# Altium project ADC1.PrjPcb
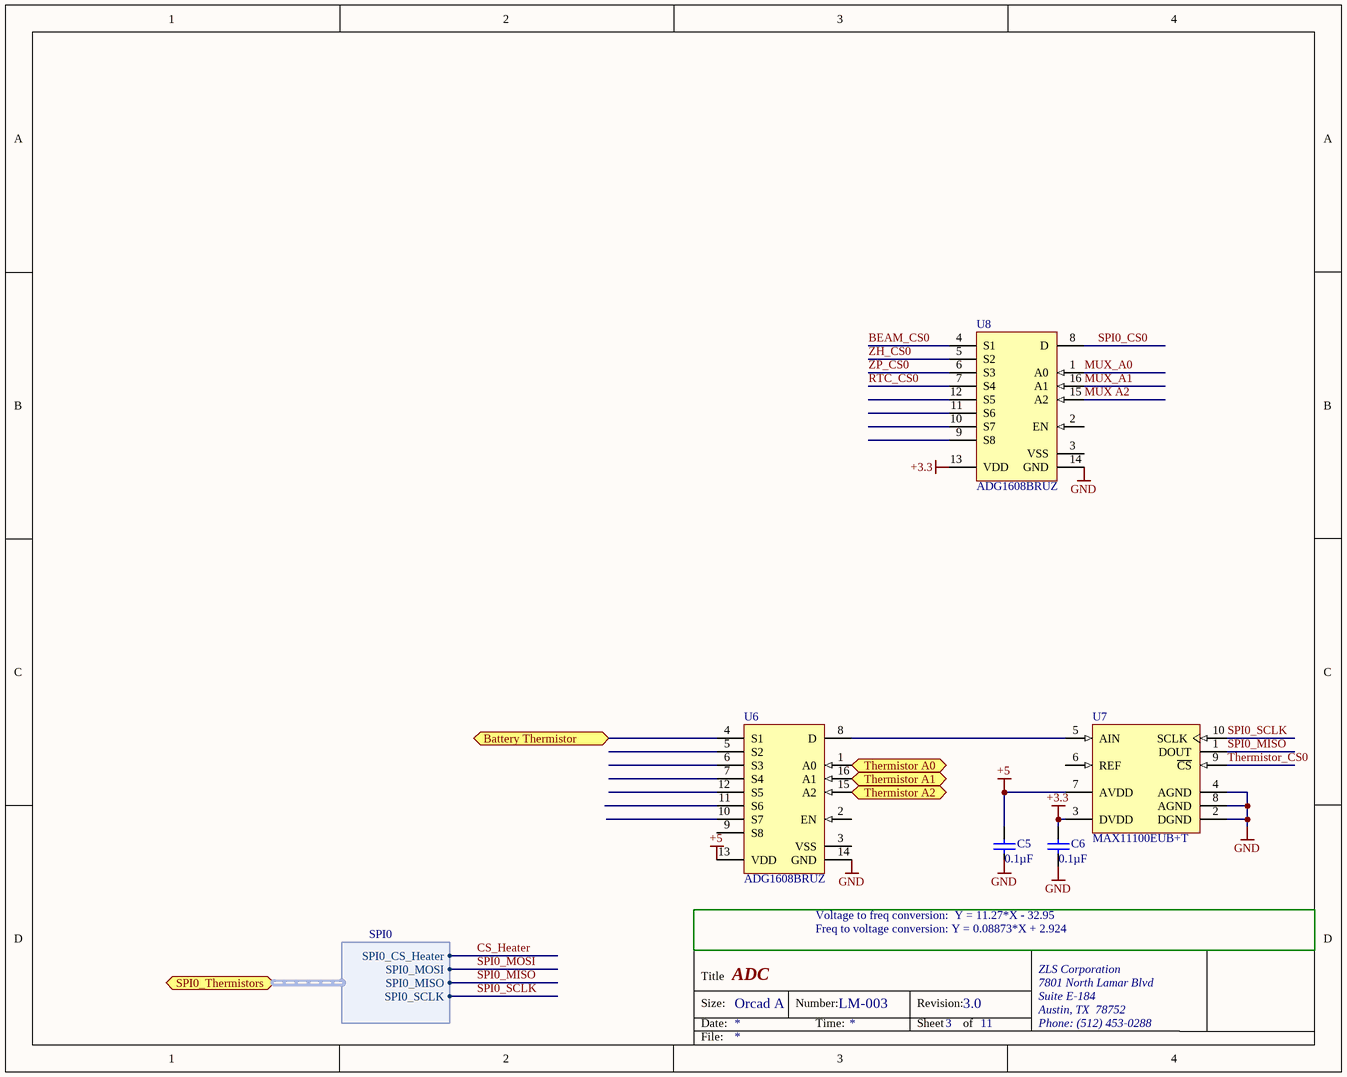
[diagram p0: ADC.SchDoc]
1 sheet, 5 parts. Net scope: flat (ports and power ports of the same name join across sheets).

## Sheet ADC.SchDoc: ADC
size OrCAD A; DocumentNumber: LM-003; Revision: 3.0; SheetNumber: 3; SheetTotal: 11

### Parts
C5  Capacitance: 0.1µF  [CAPC0805(2012)145_N]  (hidden comment: CAP CER 0.1UF 25V X7R 0805)
C6  Capacitance: 0.1µF  [CAPC0805(2012)145_N]  (hidden comment: CAP CER 0.1UF 25V X7R 0805)
U6  ADG1608BRUZ  [ADI-RU-16_M]
U7  MAX11100EUB+T  [U10+2_L]
U8  ADG1608BRUZ  [ADI-RU-16_M]

### Ports
Battery Thermistor, SPI0_Thermistors (harness SPI0), Thermistor A0, Thermistor A1, Thermistor A2

### Harnesses
SPI0: SPI0_CS_Heater, SPI0_MOSI, SPI0_MISO, SPI0_SCLK

### Nets
+3.3: C6.1 U7.3(DVDD) U8.13(VDD)
+5: C5.1 U6.13(VDD) U7.7(AVDD)
GND: C6.2 U6.14(GND) U7.2(DGND) U7.4(AGND) U7.8(AGND) U8.14(GND)
BEAM_CS0: U8.4(S1)
CS_Heater: port SPI0_Thermistors.SPI0_CS_Heater
MUX A2: U8.15(A2)
MUX_A0: U8.1(A0)
MUX_A1: U8.16(A1)
RTC_CS0: U8.7(S4)
SPI0_CS0: U8.8(D)
SPI0_MISO: U7.1(DOUT) ; port SPI0_Thermistors.SPI0_MISO
SPI0_MOSI: port SPI0_Thermistors.SPI0_MOSI
SPI0_SCLK: U7.10(SCLK) ; port SPI0_Thermistors.SPI0_SCLK
Thermistor_CS0: U7.9(~{CS})
ZH_CS0: U8.5(S2)
ZP_CS0: U8.6(S3)
NetU6_1: U6.1(A0) ; port Thermistor A0
NetU6_4: U6.4(S1) ; port Battery Thermistor
NetU6_8: U6.8(D) U7.5(AIN)
NetU6_15: U6.15(A2) ; port Thermistor A2
NetU6_16: U6.16(A1) ; port Thermistor A1

Not connected (* = marked no-connect by the designer): C5 2; U6 2(EN) 3(VSS) 5(S2) 6(S3) 7(S4) 9(S8) 10(S7) 11(S6) 12(S5); U7 6(REF); U8 2(EN) 3(VSS) 9(S8) 10(S7) 11(S6) 12(S5)

### Notes on the sheet
- Freq to voltage conversion: Y = 0.08873*X + 2.924
- Voltage to freq conversion:  Y = 11.27*X - 32.95
- Labels drawn without touching a wire or pin: GND
- Title
- Size:
- Date:
- Orcad A
- Number:
- Time:
- Revision:
- Sheet
- of
- ZLS Corporation
- 7801 North Lamar Blvd
- Suite E-184
- Austin, TX  78752
- Phone: (512) 453-0288
- File:

### Library data of the parts
C5 C6 = CMP-1036-04795-1: Manufacturer: Murata Electronics North America; Manufacturer Part Number: GRM21BR71E104KA01L; Tolerance: ±10%; Supplier 1: Digi-Key; Supplier Part Number 1: 490-1673-6-ND; RoHS: RoHS Compliant; Category: Capacitors; Stock 1: 891652; Pricing 1: 1=0.2, 10=0.145, 100=0.0683, 500=0.04788, 1000=0.03964 (USD); Packaging: Digi-Reel®; Part Status: Active; Voltage - Rated: 25V; Temperature Coefficient: X7R; Operating Temperature: -55°C ~ 125°C; Features: -; Ratings: -; Applications: General Purpose; Mounting Type: Surface Mount, MLCC; Package / Case: 0805 (2012 Metric); Size / Dimension: 0.079" L x 0.049" W (2.00mm x 1.25mm); Height - Seated (Max): -; Thickness (Max): 0.053" (1.35mm); Lead Spacing: -; Lead Style: -; ComponentLink1URL: http://www.murata.com/~/media/webrenewal/support/library/catalog/products/capacitor/mlcc/c02e.ashx; ComponentLink1Description: http://www.murata.com/~/media/webrenewal/support/library/catalog/products/capacitor/mlcc/c02e.ashx
U6 U8 = CMP-0793-00136-1: 4.5 Ohm Ron, 8-Channel +/-5 V,+12 V, +5 V and +3.3 V Multiplexer, 16-pin SOP (RU-16), Tube; Manufacturer: Analog Devices; Max Analog Signal Range: 0 to Vdd; Ron (ohms): 4.4; t transition (s): 150n; Bandwidth (Hz): 40M, 40M, 37M, 34M; Code_JEDEC: MO-153AB; PackageReference: RU-16; PackageDescription: 16-Pin Thin Shrink Small Outline Package, Body 5 x 4.4 mm, Pitch 0.65 mm; ComponentLink1Description: Manufacturer URL; ComponentLink2Description: Datasheet; PartNumber: ADG1608BRUZ; Mounting Technology: Surface Mount; PackageVersion: Nov-02; ComponentLink3Description: Package Specification; DatasheetVersion: Rev. 0; Packing: Tube; ComponentLink1URL: http://www.analog.com/en/index.html; ComponentLink3URL: http:/www.analog.com/static/imported-files/packages/36244347913743854010197452789RU16.pdf; ComponentLink2URL: http://www.analog.com/static/imported-files/data_sheets/ADG1608_1609.pdf
U7 = CMP-0249-00017-1: 16-Bit, +5V, 200ksps ADC with 10uA Shutdown, 10-Pin uMAX, -40°C to +85°C, Pb-Free, Tape and Reel; DatasheetVersion: Rev 1, Jan-2012; ComponentLink3URL: http://pdfserv.maxim-ic.com/package_dwgs/21-0061.PDF; PackageReference: U10+2; ComponentLink2URL: http://datasheets.maxim-ic.com/en/ds/MAX11100.pdf; PackageVersion: revL, 2008; ComponentLink1Description: Manufacturer URL; Code_JEDEC: MO-187-BA; ComponentLink1URL: http://www.maxim-ic.com; ComponentLink3Description: Package Specification; PackageDescription: 10-Pin Micro-MAX Thin Shrink Small Outline (uSOP), 3 x 3 x 0.85 mm Body, 0.5 mm Pitch, Pb-Free; ComponentLink2Description: Datasheet